# EAGLE design ExosLPBatt (EAGLE 7.3.0)
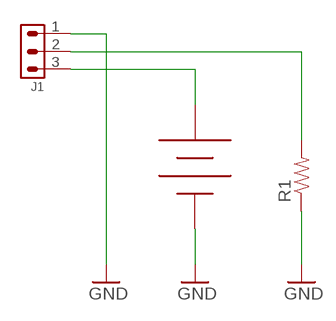
[diagram p0: schematic, sheet 1]

## Parts
J1  CONN_3X1_JST_PA  [CONN_3X1_JST_PA]
R1  0603_RES  [0603]
U$2  14500_KEYSTONE_1024  [14500_KEYSTONE_1024]

## Nets
GND: J1.1 R1.P$1 U$2.NEG
N$1: J1.2 R1.P$2
N$2: J1.3 U$2.POS

## Library data of the parts
J1 = leaf:CONN_3X1_JST_PA
R1 = stepOSP:0603_RES
U$2 = stepOSP:14500_KEYSTONE_1024

## Board
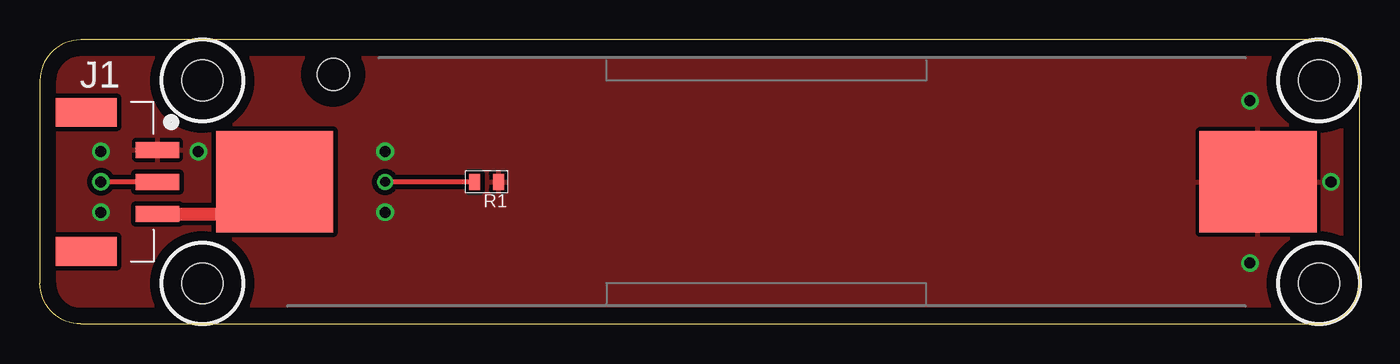
[diagram p1: board, top side]
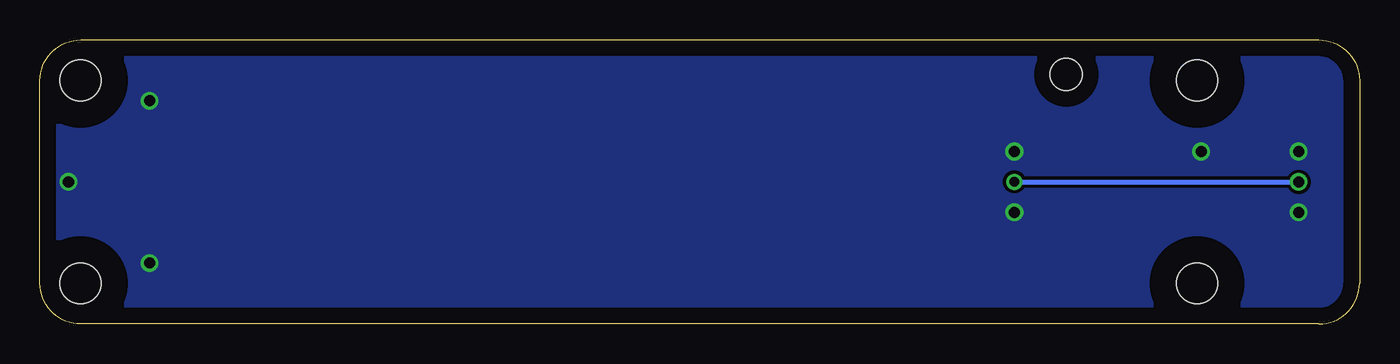
[diagram p2: board, bottom side, seen from below]

Size 82.55 x 17.78 mm. Coordinates in mm from the lower left corner, seen from the top.
Outline: 2.54,0 80.01,0 arc90 82.55,2.54 82.55,15.24 arc90 80.01,17.78 2.54,17.78 arc90 0,15.24 0,2.54 arc90 2.54,0
Copper layers (1*16): Top 0.035mm / dielectric 1.5mm / Bottom 0.035mm
Design rules "default": minimum track width 10mil, minimum drill 24mil, track to track 8mil, track to pad 8mil, pad to pad 8mil, via to via 8mil, smd to smd 8mil, copper to edge 40mil, drill to drill 8mil, minimum pad ring 10mil, minimum via ring 8mil, stop-mask expansion 4mil, vias tented up to drill 0mil, thermal gap 10mil
Holes 2.54 mm at 10.16,15.24 10.16,2.54 80.01,15.24 80.01,2.54
tRestrict: area 7.6,12.7 to 12.7,17.8; area 7.6,0 to 12.7,5.1; area 77.5,12.7 to 82.6,17.8; area 77.5,0 to 82.6,5.1
bRestrict: area 77.5,0 to 82.6,5.1; area 7.6,12.7 to 12.7,17.8; area 7.6,0 to 12.7,5.1; area 77.5,12.7 to 82.6,17.8

### Footprints (pad centres in the part's own frame; a part is rotated, then mirrored left to right if it is on the bottom)
CONN_3X1_JST_PA = smd 1 x 2.7: 1 2,-9.15; 2 0,-9.15; 3 -2,-9.15 | smd 1.8 x 3.8: P$1 4.35,-4.7; P$2 -4.35,-4.7
0603 = smd 0.7 x 1: P$1 -0.75,0; P$2 0.75,0
14500_KEYSTONE_1024 = smd 7.34 x 6.35: NEG 0,0; POS 61.52,0 | hole 1.98: 57.85,-6.73

### Placement (x,y rotation side)
J1  -1.8,8.89 90 top
R1  27.94,8.89 180 top
U$2  76.2,8.89 180 top

### Tracks (layer width: path | path; a pad name or v marks a point on that pad's centre or on a via)
GND  (via drill 0.7)
  other vias: 3.81,10.79 21.59,10.79 3.81,6.99 21.59,6.99 80.77,8.89 9.91,10.79 75.69,13.97 75.69,3.81
  pour Top (isolate 0.305): 0,0 82.55,0 82.55,17.78 0,17.78
  pour Bottom: 0,0 82.55,0 82.55,17.78 0,17.78
N$1  (via drill 0.6, 0.7)
  Top 0.305: J1.2 v3.81,8.89 | R1.P$2 v21.59,8.89
  Bottom 0.305: v21.59,8.89 v3.81,8.89
N$2
  Top 0.813: J1.3 14.68,6.89 U$2.POS